# EAGLE design eeZeeAudioJack (EAGLE 7.1.0)
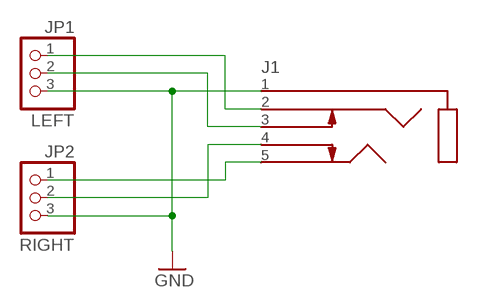
[diagram p0: schematic, sheet 1]

## Parts
J1  STEREO_JACK3F07  [3.5AUDIO_3F07]
JP1  LEFT  PINHD-1X03_2.54-S  [1X03-S]
JP2  RIGHT  PINHD-1X03_2.54-S  [1X03-S]

## Nets
GND: J1.1(SLEEVE) JP1.3 JP2.3
RING: J1.5(RING) JP2.1
RING_SW: J1.4(RSWITCH) JP2.2
TIP: J1.2(TIP) JP1.1
TIP_SW: J1.3(TSWITCH) JP1.2

## Library data of the parts
J1 = bt_electromech:STEREO_JACK: 3.5mm Stereo Audio Jack with insert detect switches.
JP1 JP2 = pinhead-2:PINHD-1X03: PIN HEADER

## Board
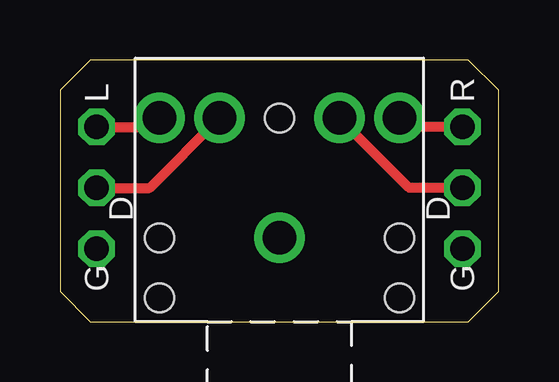
[diagram p1: board, top side]
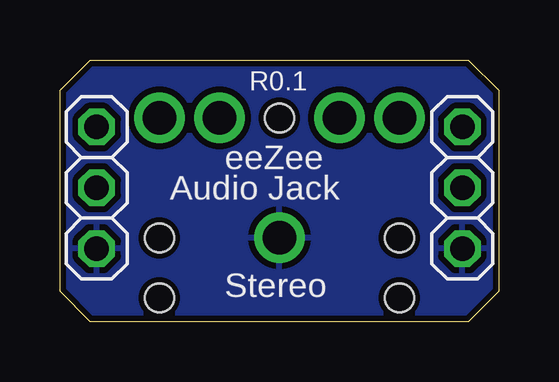
[diagram p2: board, bottom side, seen from below]

Size 18.29 x 10.92 mm. Coordinates in mm from the lower left corner, seen from the top.
Outline: 17.02,10.92 1.27,10.92 0,9.65 0,1.27 1.27,0 17.02,0 18.29,1.27 18.29,9.65 17.02,10.92
Copper layers (1*16): Top 0.0356mm / dielectric 1.5011mm / Bottom 0.0356mm
Design rules "LaenPCBOrder": minimum track width 6mil, minimum drill 13mil, track to track 10mil, track to pad 10mil, pad to pad 10mil, via to via 10mil, smd to smd 8mil, copper to edge 10mil, drill to drill 10mil, minimum pad ring 7mil, minimum via ring 7mil, stop-mask expansion 3mil, vias tented up to drill 20mil, thermal gap 10mil

### Footprints (pad centres in the part's own frame; a part is rotated, then mirrored left to right if it is on the bottom)
3.5AUDIO_3F07 = drill 1.4: 1 0,3.5; 2 -5,8.5; 3 -2.5,8.5; 4 2.5,8.5; 5 5,8.5 | hole 1.2: -5,3.5; -5,1; 5,1; 5,3.5; 0,8.5
1X03-S = drill 1.016 octagon: 1 -2.54,0; 2 0,0; 3 2.54,0

### Placement (x,y rotation side)
J1  9.14,0 0 top
JP1  1.52,5.59 270 bottom
JP2  16.76,5.59 270 bottom

### Tracks (layer width: path | path; a pad name or v marks a point on that pad's centre or on a via)
GND
  pour Bottom: 0,1.27 0,9.65 1.27,10.92 17.02,10.92 18.29,9.65 18.29,1.27 17.02,0 1.27,0
RING
  Top 0.406: JP2.1 14.52,8.13 J1.5
RING_SW
  Top 0.406: JP2.2 14.56,5.59 J1.4
TIP
  Top 0.406: JP1.1 3.77,8.13 J1.2
TIP_SW
  Top 0.406: JP1.2 3.73,5.59 J1.3

### Text on the board
tNames: L | R | D | D | G | G
bNames: R0.1 | eeZee | Audio Jack | Stereo